# Altium schematic sheet Qunyin_mmWave_esp32_flasher.SchDoc: mmWave_iwr6843aop
size 457 x 292 mm; DrawnBy: Wxd; Organization: Shanghai Qunyin; Address1: Xianxia Rd 601; Address2: Changning district; Address3: Shanghai; DocumentNumber: 6; SheetNumber: 6; SheetTotal: 6
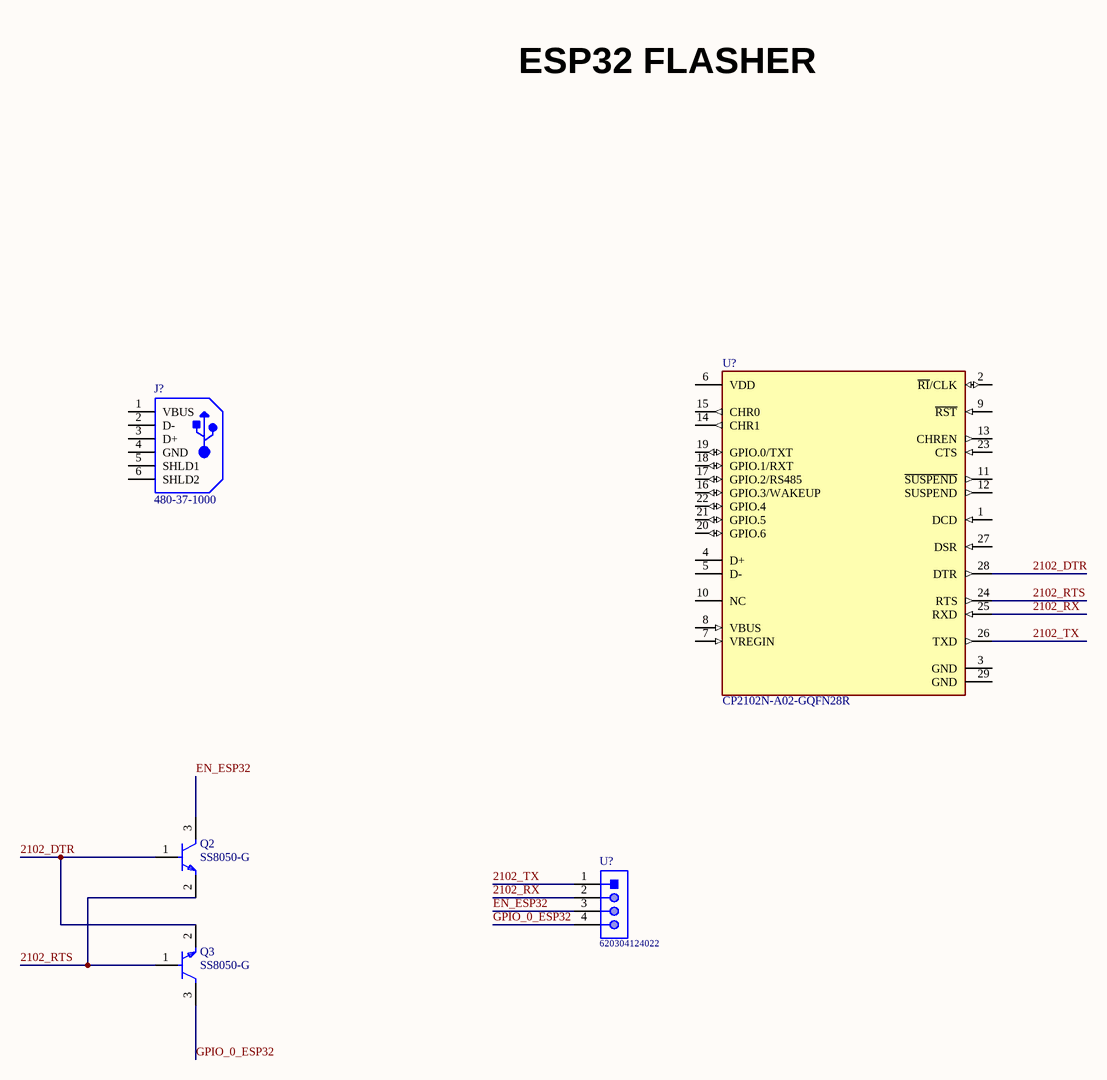
[diagram p0: Qunyin_mmWave_esp32_flasher.SchDoc]

## Parts
(Parts that share a designator on the sheet are numbered #1, #2 ... from top to bottom, then left to right.)
J?  480-37-1000  [MOLX-480-37-1000_V]
Q2  SS8050-G  [FP-SS8050-G-MFG]
Q3  SS8050-G  [FP-SS8050-G-MFG]
U?#1  CP2102N-A02-GQFN28R  [FP-CP2102N-A02-GQFN28R-MFG]
U?#2  620304124022  [620304124022]

## Nets
2102_DTR: Q2.1(B) Q3.2(E) U?#1.28(DTR)
2102_RTS: Q2.2(E) Q3.1(B) U?#1.24(RTS)
2102_RX: U?#1.25(RXD) U?#2.2
2102_TX: U?#1.26(TXD) U?#2.1
EN_ESP32: Q2.3(C) U?#2.3
GPIO_0_ESP32: Q3.3(C) U?#2.4

Not connected (* = marked no-connect by the designer): J? 1(VBUS) 2(D-) 3(D+) 4(GND) 5(SHLD1) 6(SHLD2); U?#1 1(DCD) 2(~{RI}/CLK) 3(GND) 4(D+) 5(D-) 6(VDD) 7(VREGIN) 8(VBUS) 9(~{RST}) 10(NC) 11(~{SUSPEND}) 12(SUSPEND) 13(CHREN) 14(CHR1) 15(CHR0) 16(GPIO.3/WAKEUP) 17(GPIO.2/RS485) 18(GPIO.1/RXT) 19(GPIO.0/TXT) 20(GPIO.6) 21(GPIO.5) 22(GPIO.4) 23(CTS) 27(DSR) 29(GND)

## Notes on the sheet
- ESP32 FLASHER
- Title
- Size:
- Date:
- Number:
- Time:
- Revision:
- File:

## Library data of the parts
J? = CMP-1676-00005-1: Universal Serial Bus (USB) Shielded I/O Plug, Type A, Right Angle Connector, 1.5 A, -20 to 85 degC, 4-Pin SMD, RoHS, Tray; Tolerance: 1%; Power Rating: 100 mW; Voltage Rating: 50 V; Case\Package: 0603; Resistance: 1 mohm; Width: 0.8 mm; Mount: Surface Mount; ComponentLink1URL: http://www.molex.com/; ComponentLink1Description: Manufacturer URL; REACH SVHC: No SVHC; Case Code (Imperial): 0603; Height: 0.45 mm; Max Operating Temperature: 155 degC; ComponentLink2Description: Datasheet; Min Operating Temperature: -55 degC; Length: 1.6 mm; Pins: 2; RoHSCompliant: true; Package Quantity: 5000; DatasheetVersion: Rev. D, 06/2004; PackageDescription: 4-Pin Surface Mount Device, Body 12 x 18.8 mm; Voltage Rating (DC): 50 V; PackageReference: 480-37-1000; Case Code (Metric): 1608; ComponentLink2URL: http://www.molex.com/pdm_docs/sd/480371000_sd.pdf; Packaging: Tape and Reel
Q2 Q3 = CMP-20235-000001-1: NPN TRANSISTOR 1.5A 40V SOT-23 R; Transition Frequency: 100MHz; Max Breakdown Voltage: 25V; Collector Emitter Voltage (VCEO): 400mV; Max Power Dissipation: 300mW; Max Collector Current: 1.5A; Case/Package: TO-236-3; Packaging: Tape and Reel; RoHS Compliant: Yes; Mount: Surface Mount; Collector Emitter Breakdown Voltage: 25V
U?#1 = CMP-08093-000007-1: IC USB TO UART BRIDGE QFN28
U?#2 = CMP-1502-00662-1: Male Shrouded Header WR-WTB, SMT, Vertical, pitch 2 mm, 1 x 4 position; Manufacturer: Wurth Elektronik; Working Voltage: 100VAC; Contact Resistance: 20mOhm; Pitch: 2mm; Position: 1x4; Part Number: 620304124022; Orientation: Vertical; Publisher: WurthElektronik; Packaging: TapeandReel; Gender: Male; Mounting Technology: SMT; Operating Temperature: -25to85degC; Manufacturer URL: http://www.we-online.de; Package Reference: 620304124022; Datasheet URL: https://katalog.we-online.de/em/datasheet/6203xx124022.pdf